# Altium project MPPT_controller.PrjPcb (part 1 of 2)
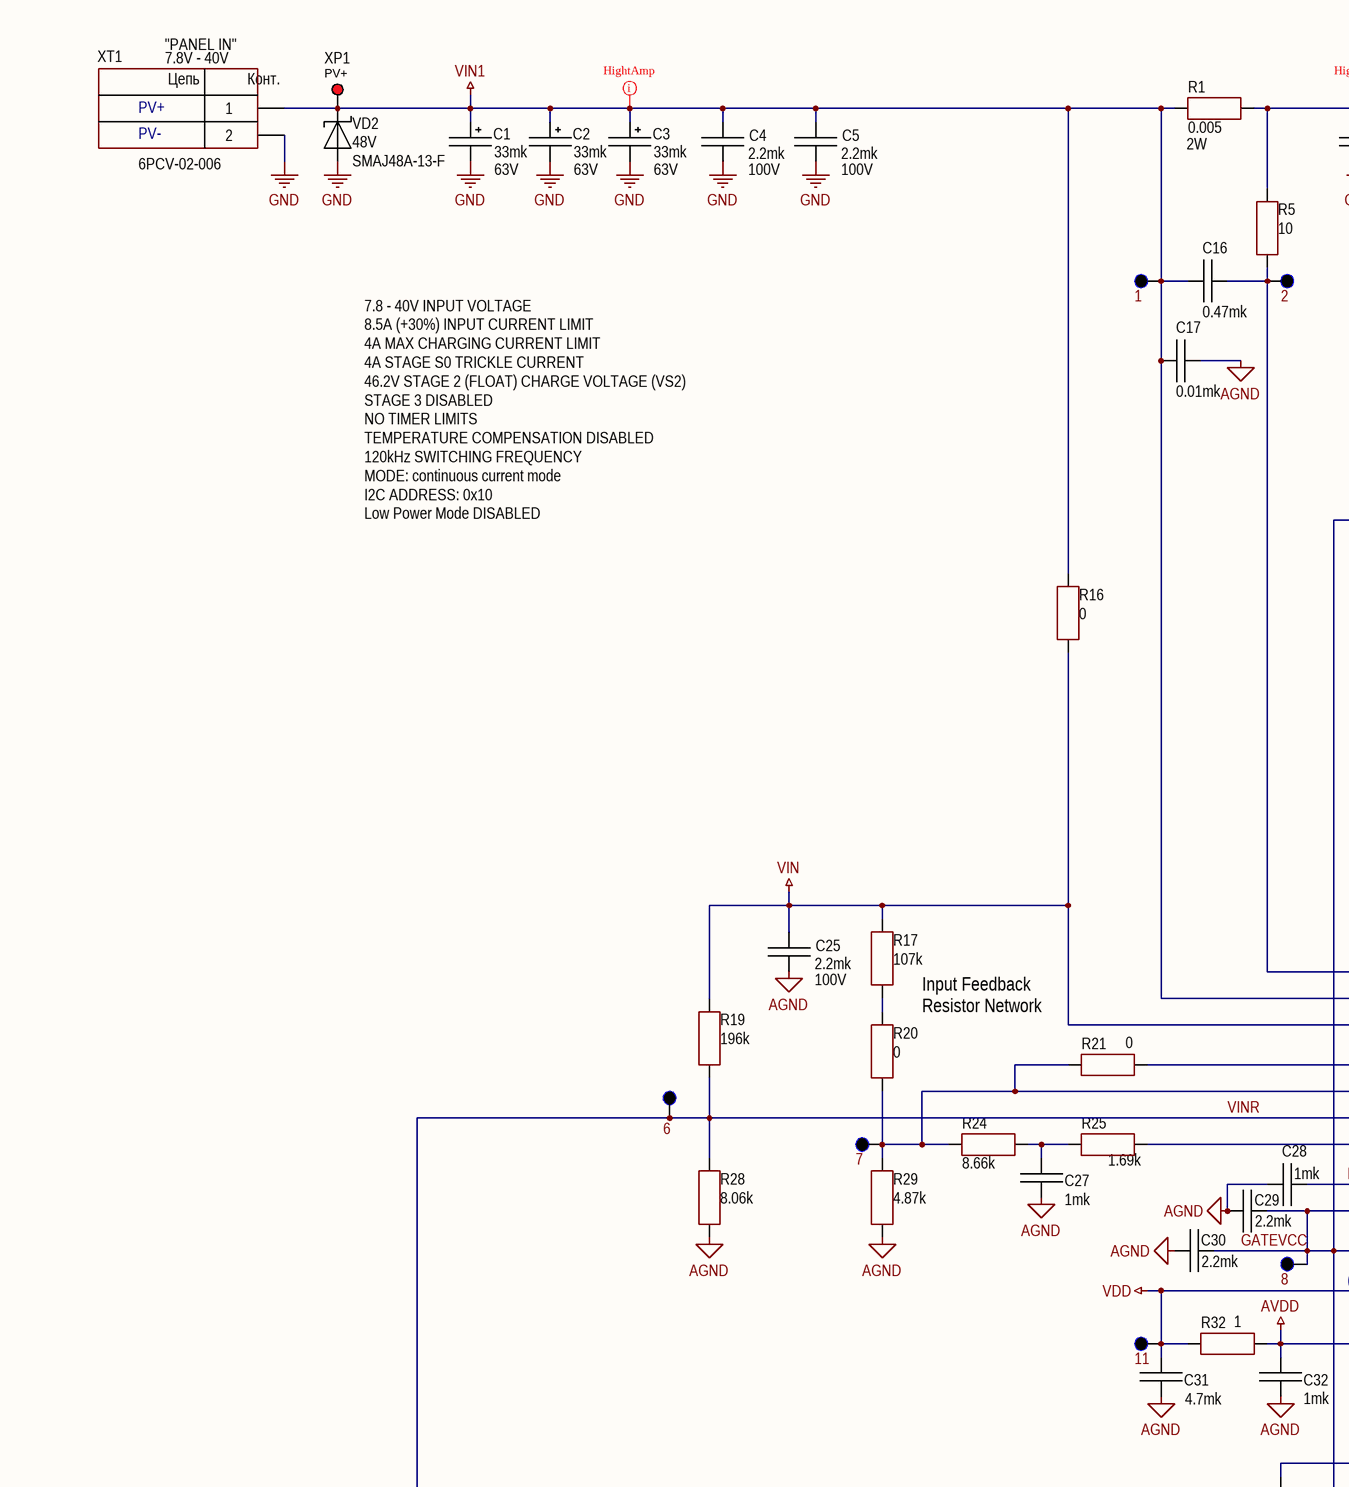
[diagram p0: Sheet1.SchDoc, top left]
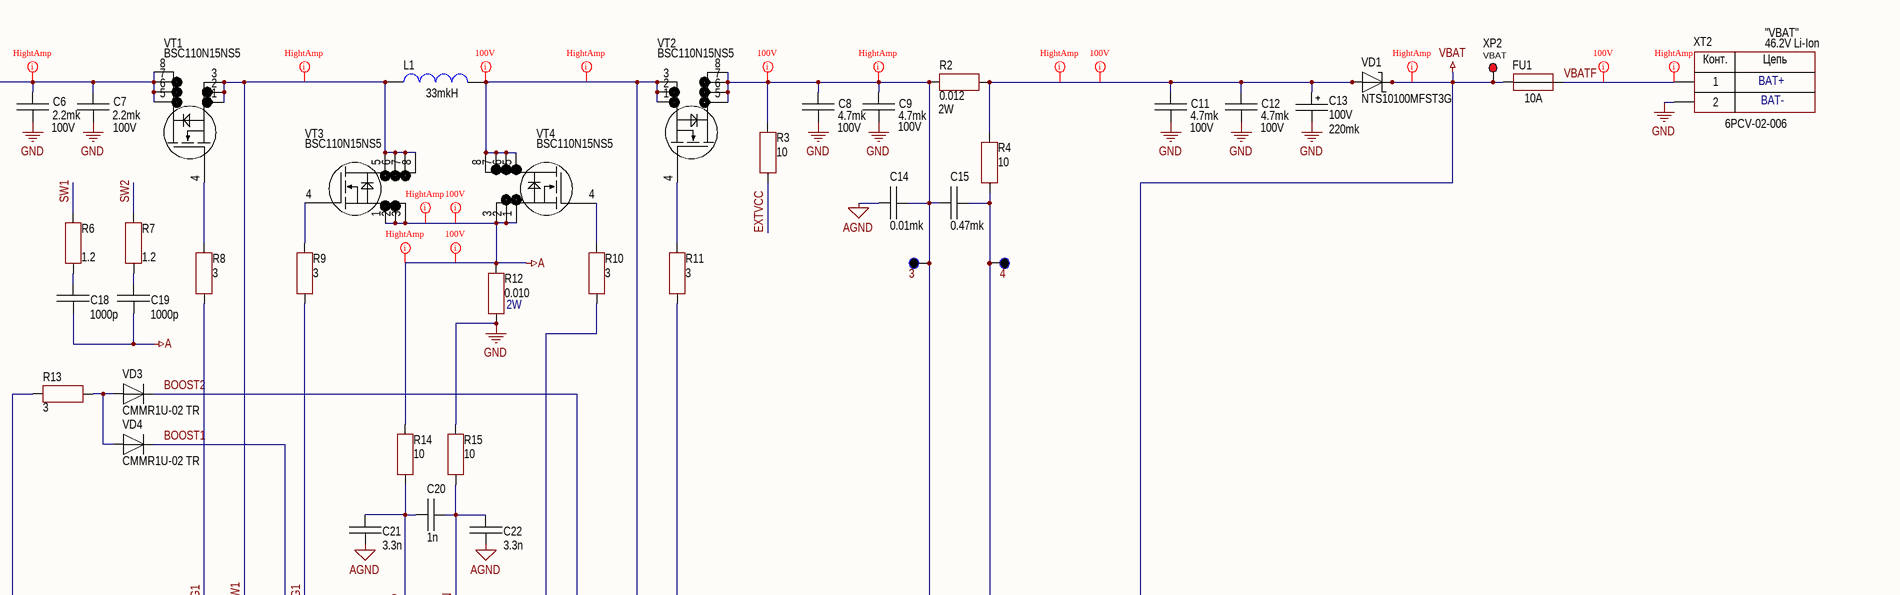
[diagram p1: Sheet1.SchDoc, top right]
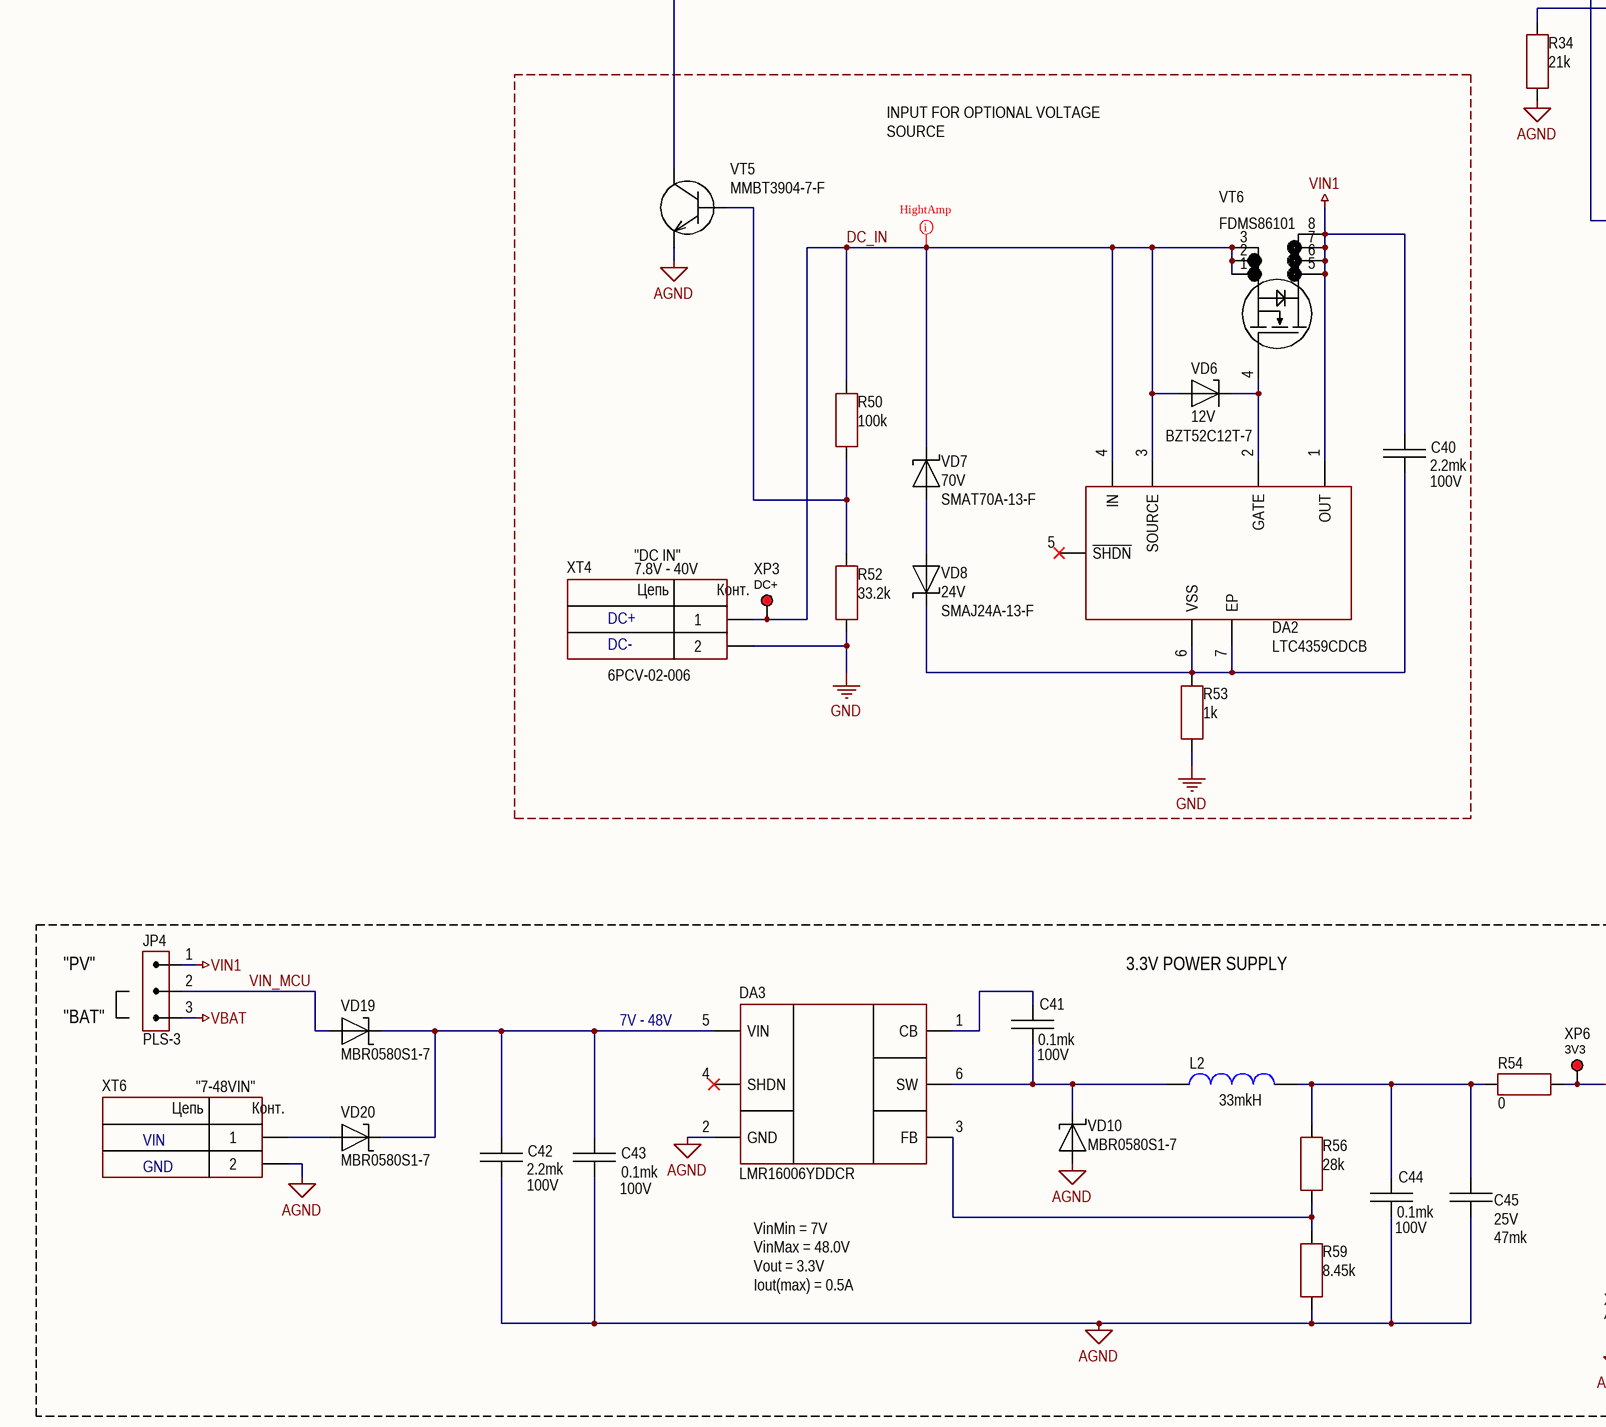
[diagram p2: Sheet1.SchDoc, bottom left]
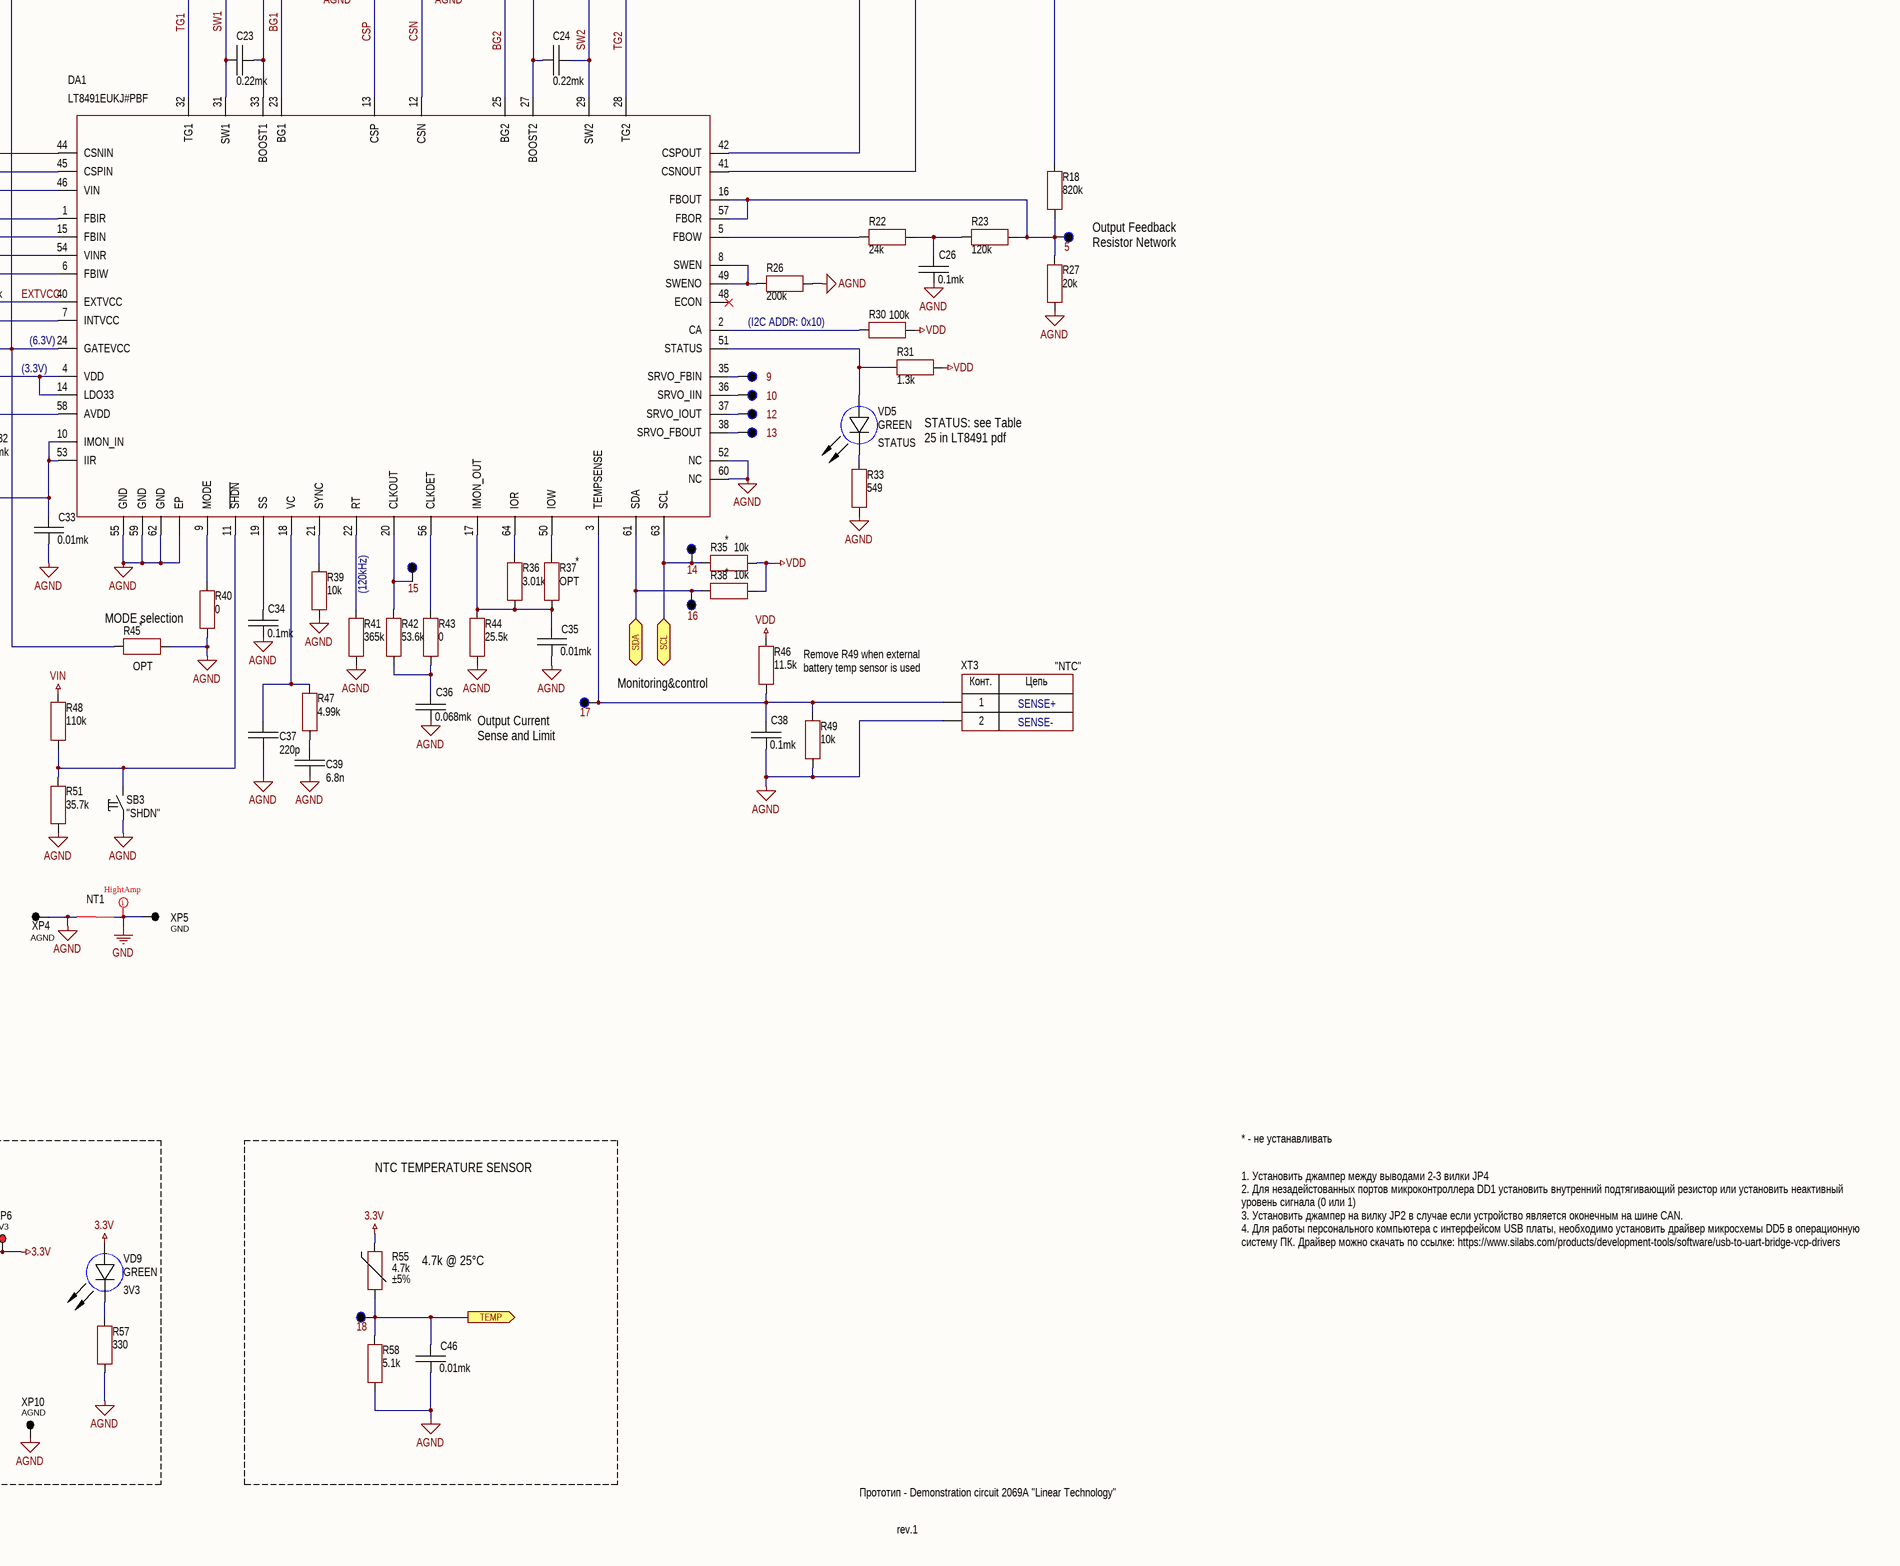
[diagram p3: Sheet1.SchDoc, bottom right]
2 sheets, 283 parts. Net scope: global (net labels, ports and power ports of the same name join across sheets).
Board file: PCB_MPPT_rev1.PcbDoc
Sheets:
  Sheet1.SchDoc
  Sheet2.SchDoc

## Sheet Sheet1.SchDoc
size 840 x 594 mm; Language: en; ResponsibleDept: DED; DocumentStatus: Released; DecimalNumber: {DecimalNumber}; CheckedBy: Грефенштейн; DrawnBy: Тихонов; SheetNumber: 1; SheetTotal: 2; Title0: Плата заряда аккумулятора; DocumentType: Схема электрическая принципиальная; PageSetup: Record=PageOptions|CenterHorizontal=True|CenterVertical=True|PrintScale=0.96|XCorrection=1.00|YCorrection=1.00|PrintKind=1|BorderSize=5000000|LeftOffset=0|BottomOffset=0|Orientation=2|PaperLength=1000|PaperWidth=1000|Scale=100|PaperSource=7|PrintQuality=-4|MediaType=1|DitherType=10|PaperKind=A3|PrintScaleMode=1

### Parts
1  test  [TEST_point_SMD]  (value not drawn)  (no BOM)
2  test  [TEST_point_SMD]  (value not drawn)  (no BOM)
3  test  [TEST_point_SMD]  (value not drawn)  (no BOM)
4  test  [TEST_point_SMD]  (value not drawn)  (no BOM)
5  test  [TEST_point_SMD]  (value not drawn)  (no BOM)
6  test  [TEST_point_SMD]  (value not drawn)  (no BOM)
7  test  [TEST_point_SMD]  (value not drawn)  (no BOM)
8  test  [TEST_point_SMD]  (value not drawn)  (no BOM)
9  test  [TEST_point_SMD]  (value not drawn)  (no BOM)
10  test  [TEST_point_SMD]  (value not drawn)  (no BOM)
11  test  [TEST_point_SMD]  (value not drawn)  (no BOM)
12  test  [TEST_point_SMD]  (value not drawn)  (no BOM)
13  test  [TEST_point_SMD]  (value not drawn)  (no BOM)
14  test  [TEST_point_SMD]  (value not drawn)  (no BOM)
15  test  [TEST_point_SMD]  (value not drawn)  (no BOM)
16  test  [TEST_point_SMD]  (value not drawn)  (no BOM)
17  test  [TEST_point_SMD]  (value not drawn)  (no BOM)
18  test  [TEST_point_SMD]  (value not drawn)  (no BOM)
C1  value 33mk  Voltage: 63V  [CAP: EEH-ZA_SIZE-F]
C2  value 33mk  Voltage: 63V  [CAP: EEH-ZA_SIZE-F]
C3  value 33mk  Voltage: 63V  [CAP: EEH-ZA_SIZE-F]
C4  value 2.2mk  Voltage: 100V  [CAP: 1210]
C5  value 2.2mk  Voltage: 100V  [CAP: 1210]
C6  value 2.2mk  Voltage: 100V  [CAP: 1210]
C7  value 2.2mk  Voltage: 100V  [CAP: 1210]
C8  value 4.7mk  Voltage: 100V  [CAP: 1812]
C9  value 4.7mk  Voltage: 100V  [CAP: 1812]
C11  value 4.7mk  Voltage: 100V  [CAP: 1812]
C12  value 4.7mk  Voltage: 100V  [CAP: 1812]
C13  value 220mk  Voltage: 100V  [CAP: D13C5H25]
C14  value 0.01mk  [CAP: 0603]
C15  value 0.47mk  [CAP: 0603]
C16  value 0.47mk  [CAP: 0603]
C17  value 0.01mk  [CAP: 0603]
C18  value 1000p  [CAP: 1206]
C19  value 1000p  [CAP: 1206]
C20  value 1n  [CAP: 0603]
C21  value 3.3n  [CAP: 0603]
C22  value 3.3n  [CAP: 0603]
C23  value 0.22mk  [CAP: 0603]
C24  value 0.22mk  [CAP: 0603]
C25  value 2.2mk  Voltage: 100V  [CAP: 1210]
C26  value 0.1mk  [CAP: 0603]
C27  value 1mk  [CAP: 0603]
C28  value 1mk  [CAP: 1210]
C29  value 2.2mk  [CAP: 0603]
C30  value 2.2mk  [CAP: 0603]
C31  value 4.7mk  [CAP: 0805]
C32  value 1mk  [CAP: 0603]
C33  value 0.01mk  [CAP: 0603]
C34  value 0.1mk  [CAP: 0603]
C35  value 0.01mk  [CAP: 0603]
C36  value 0.068mk  [CAP: 0603]
C37  value 220p  [CAP: 0603]
C38  value 0.1mk  [CAP: 0603]
C39  value 6.8n  [CAP: 0603]
C40  value 2.2mk  Voltage: 100V  [CAP: 1210]
C41  value 0.1mk  Voltage: 100V  [CAP: 0603]
C42  value 2.2mk  Voltage: 100V  [CAP: 1210]
C43  value 0.1mk  Voltage: 100V  [CAP: 0603]
C44  value 0.1mk  Voltage: 100V  [CAP: 0603]
C45  value 47mk  Voltage: 25V  [CAP: 1206]
C46  value 0.01mk  [CAP: 0603]
DA1  LT8491EUKJ#PBF  [64-Lead Plastic QFN]
DA2  (no value)  [6-DFN-6_DCB-M]
DA3  (no value)  [SOT23-6 Thin]
FU1  value 10A  [FUSE: 01110501Z (5x20 mm)]
JP4  (no value)  [CON: PLS-3]
L1  value 33mkH  [IND: WE-HCF_2013]
L2  value 33mkH  [IND: SRU8043]
NT1  (no value)  [NetTie_0805_2]  (net tie, no BOM)
R1  value 0.005  Power: 2W  [RES: 2512]
R2  value 0.012  Power: 2W  [RES: 2512]
R3  value 10  [RES: 0603]
R4  value 10  [RES: 0603]
R5  value 10  [RES: 0603]
R6  value 1.2  [RES: 1206]
R7  value 1.2  [RES: 1206]
R8  value 3  [RES: 0603]
R9  value 3  [RES: 0603]
R10  value 3  [RES: 0603]
R11  value 3  [RES: 0603]
R12  value 0.010  Power: 2W  [RES: 2512]
R13  value 3  [RES: 0603]
R14  value 10  [RES: 0603]
R15  value 10  [RES: 0603]
R16  value 0  [RES: 0603]
R17  value 107k  [RES: 0603]
R18  value 820k  [RES: 0603]
R19  value 196k  [RES: 0603]
R20  value 0  [RES: 0603]
R21  value 0  [RES: 0603]
R22  value 24k  [RES: 0603]
R23  value 120k  [RES: 0603]
R24  value 8.66k  [RES: 0603]
R25  value 1.69k  [RES: 0603]
R26  value 200k  [RES: 0603]
R27  value 20k  [RES: 0603]
R28  value 8.06k  [RES: 0603]
R29  value 4.87k  [RES: 0603]
R30  value 100k  [RES: 0603]
R31  value 1.3k  [RES: 0603]
R32  value 1  [RES: 0603]
R33  value 549  [RES: 0603]
R34  value 21k  [RES: 0603]
R35  value 10k  [RES: 0603]
R36  value 3.01k  [RES: 0603]
R37  ShowComment: OPT  [RES: 0603]
R38  value 10k  [RES: 0603]
R39  value 10k  [RES: 0603]
R40  value 0  [RES: 0603]
R41  value 365k  [RES: 0603]
R42  value 53.6k  [RES: 0603]
R43  value 0  [RES: 0603]
R44  value 25.5k  [RES: 0603]
R45  ShowComment: OPT  [RES: 0603]
R46  value 11.5k  [RES: 0603]
R47  value 4.99k  [RES: 0603]
R48  value 110k  [RES: 0603]
R49  value 10k  [RES: 0603]
R50  value 100k  [RES: 0603]
R51  value 35.7k  [RES: 0603]
R52  value 33.2k  [RES: 0603]
R53  value 1k  [RES: 0603]
R54  value 0  [RES: 0603]
R55  value 4.7k  Tolerance: ±5%  [RES: 0805]
R56  value 28k  [RES: 0603]
R57  value 330  [RES: 0603]
R58  value 5.1k  [RES: 0805]
R59  value 8.45k  [RES: 0603]
SB3  CommentText: "SHDN"  [BUT: 6x6 SMD]
VD1  PartNumber: NTS10100MFST3G  [PG-TDSON-8-7]
VD2  Voltage: 48V  PartNumber: SMAJ48A-13-F  [DIODE: SMA]
VD3  PartNumber: CMMR1U-02 TR  [DIODE: SOD123F]
VD4  PartNumber: CMMR1U-02 TR  [DIODE: SOD123F]
VD5  Color: GREEN  ShowComment: STATUS  [LED: 0603G]
VD6  Voltage: 12V  PartNumber: BZT52C12T-7  [DIODE: SOD523]
VD7  Voltage: 70V  PartNumber: SMAT70A-13-F  [DIODE: SMA]
VD8  Voltage: 24V  PartNumber: SMAJ24A-13-F  [DIODE: SMA]
VD9  Color: GREEN  ShowComment: 3V3  [LED: 0603G]
VD10  PartNumber: MBR0580S1-7  [DIODE: SMA]
VD19  PartNumber: MBR0580S1-7  [DIODE: SMA]
VD20  PartNumber: MBR0580S1-7  [DIODE: SMA]
VT1  PartNumber: BSC110N15NS5  [PG-TDSON-8-7]  (hidden comment: MOSFET N-ch, 150V, PG-TDSON-8)
VT2  PartNumber: BSC110N15NS5  [PG-TDSON-8-7]  (hidden comment: MOSFET N-ch, 150V, PG-TDSON-8)
VT3  PartNumber: BSC110N15NS5  [PG-TDSON-8-7]  (hidden comment: MOSFET N-ch, 150V, PG-TDSON-8)
VT4  PartNumber: BSC110N15NS5  [PG-TDSON-8-7]  (hidden comment: MOSFET N-ch, 150V, PG-TDSON-8)
VT5  PartNumber: MMBT3904-7-F  [SOT23]
VT6  PartNumber: FDMS86101  [PG-TDSON-8-7]
XP1  PV+  [CON: Keystone5000]
XP2  VBAT  [CON: Keystone5000]
XP3  DC+  [CON: Keystone5000]
XP4  AGND  [CON: Keystone5001]
XP5  GND  [CON: Keystone5001]
XP6  3V3  [CON: Keystone5000]
XP10  AGND  [CON: Keystone5001]
XT1  PartNumber: 6PCV-02-006  CommentText: "PANEL IN"  row1: PV+  row2: PV-  [CON: 6PCV-02-006]
XT2  PartNumber: 6PCV-02-006  CommentText: "VBAT"  row1: BAT+  row2: BAT-  [CON: 6PCV-02-006]
XT3  CommentText: "NTC"  row1: SENSE+  row2: SENSE-  [CON: DG350-3.5-02P]
XT4  PartNumber: 6PCV-02-006  CommentText: "DC IN"  row1: DC+  row2: DC-  [CON: 6PCV-02-006]
XT6  CommentText: "7-48VIN"  row1: VIN  row2: GND  [CON: DG350-3.5-02P]

### Blocks framed on the sheet
7.8V - 40V: C40 DA2 R50 R52 R53 VD6-VD8 VT5 VT6 XP3 XT4
7V - 48V: C41-C45 DA3 JP4 L2 R54 R56 R57 R59 VD9 VD10 VD19 VD20 XP6 XP10 XT6

### Ports
SCL (bidir), SDA (bidir), TEMP (out)

### Nets
3.3V: R54.1 R55.2 VD9.1(A) XP6.1
A: C18.1 C19.1 R12.2 R14.1 VT3.1(S) VT3.2(S) VT3.3(S) VT4.1(S) VT4.2(S) VT4.3(S)
AGND: C14.1 C17.1 C21.2 C22.2 C25.1 C26.1 C27.1 C28.2 C29.1 C30.2 C31.1 C32.1 C33.1 C34.1 C35.1 C36.1 C37.1 C38.1 C39.1 C42.1 C43.1 C44.1 C45.1 C46.1 DA1.52(NC) DA1.55(GND) DA1.59(GND) DA1.60(NC) DA1.62(GND) DA1.65(EP) DA3.2(GND) NT1.1 R26.2 R27.1 R28.2 R29.2 R33.1 R34.1 R39.1 R40.1 R41.1 R44.1 R45.1 R49.1 R51.1 R57.1 R58.2 R59.1 SB3.1 VD10.1 VT5.2(E) XP4.1 XP10.1 XT3.2 XT6.2
AVDD: C32.2 DA1.58(AVDD) R32.2
GND: C1.2 C2.2 C3.2 C4.1 C5.1 C6.1 C7.1 C8.1 C9.1 C11.1 C12.1 C13.2 NT1.2 R12.1 R15.1 R52.1 R53.2 VD2.1(A) XP5.1 XT1.2 XT2.2 XT4.2
VBAT: FU1.1 JP4.3 R18.2 VD1.5(C) VD1.8(C) XP2.1
VDD: 11.1 C31.2 DA1.4(VDD) DA1.14(LDO33) R30.2 R31.2 R32.1 R35.1 R38.1 R46.2
VIN: C25.2 DA1.46(VIN) R16.2 R17.1 R19.1 R48.2
VIN1: 1.1 C1.1 C2.1 C3.1 C4.2 C5.2 C16.1 C17.2 C40.2 DA1.45(CSPIN) DA2.1(OUT) JP4.1 R1.2 R16.1 VD2.2(C) VT6.5(D) VT6.6(D) VT6.7(D) VT6.8(D) XP1.1 XT1.1
BG1: DA1.23(BG1) R9.1
BG2: DA1.25(BG2) R10.1
BOOST1: C23.2 DA1.33(BOOST1) VD4.2
BOOST2: C24.1 DA1.27(BOOST2) VD3.2
CSN: C20.1 C22.1 DA1.12(CSN) R15.2
CSP: C20.2 C21.1 DA1.13(CSP) R14.2
DC_IN: DA2.3(SOURCE) DA2.4(IN) R50.2 VD6.1(A) VD7.2(C) VT6.1(S) VT6.2(S) VT6.3(S) XP3.1 XT4.1
EXTVCC: C28.1 DA1.40(EXTVCC) R3.2
GATEVCC: 8.1 C29.2 C30.1 DA1.7(INTVCC) DA1.24(GATEVCC) R13.2 R45.2
SCL: 14.1 DA1.63(SCL) R35.2 ; port SCL
SDA: 16.1 DA1.61(SDA) R38.2 ; port SDA
SW1: C23.1 DA1.31(SW1) L1.2 R6.2 VT1.1(S) VT1.2(S) VT1.3(S) VT3.5(D) VT3.6(D) VT3.7(D) VT3.8(D)
SW2: C24.2 DA1.29(SW2) L1.1 R7.2 VT2.1(S) VT2.2(S) VT2.3(S) VT4.5(D) VT4.6(D) VT4.7(D) VT4.8(D)
TEMP: 18.1 C46.2 R55.1 R58.1 ; port TEMP
TG1: DA1.32(TG1) R8.1
TG2: DA1.28(TG2) R11.1
VBATF: FU1.2 XT2.1
VIN_MCU: JP4.2 VD19.1
VINR: 6.1 DA1.54(VINR) R19.2 R28.1 VT5.3(C)
Net2_1: 2.1 C16.2 DA1.44(CSNIN) R5.2
Net3_1: 3.1 C8.2 C9.2 C14.2 C15.1 DA1.42(CSPOUT) R2.2 R3.1 VT2.5(D) VT2.6(D) VT2.7(D) VT2.8(D)
Net4_1: 4.1 C15.2 DA1.41(CSNOUT) R4.2
Net5_1: 5.1 DA1.16(FBOUT) DA1.57(FBOR) R18.1 R23.1 R27.2
Net7_1: 7.1 DA1.15(FBIN) R20.2 R21.1 R24.1 R29.1
Net9_1: 9.1 DA1.35(SRVO_FBIN)
Net10_1: 10.1 DA1.36(SRVO_IIN)
Net12_1: 12.1 DA1.37(SRVO_IOUT)
Net13_1: 13.1 DA1.38(SRVO_FBOUT)
Net15_1: 15.1 DA1.20(CLKOUT) R42.2
Net17_1: 17.1 C38.2 DA1.3(TEMPSENSE) R46.1 R49.2 XT3.1
NetC6_2: C6.2 C7.2 R1.1 R5.1 VT1.5(D) VT1.6(D) VT1.7(D) VT1.8(D)
NetC11_2: C11.2 C12.2 C13.1 R2.1 R4.1 VD1.1(A) VD1.2(A) VD1.3(A)
NetC18_2: C18.2 R6.1
NetC19_2: C19.2 R7.1
NetC26_2: C26.2 R22.1 R23.2
NetC27_2: C27.2 R24.2 R25.1
NetC33_2: C33.2 DA1.10(IMON_IN) DA1.53(IIR) R34.2
NetC34_2: C34.2 DA1.19(SS)
NetC35_2: C35.2 DA1.17(IMON_OUT) R36.1 R37.2 R44.2
NetC36_2: C36.2 R42.1 R43.1
NetC37_2: C37.2 DA1.18(VC) R47.2
NetC39_2: C39.2 R47.1
NetC40_1: C40.1 DA2.6(VSS) DA2.7(EP) R53.1 VD8.2(C)
NetC41_1: C41.1 DA3.6(SW) L2.2 VD10.2
NetC41_2: C41.2 DA3.1(CB)
NetC42_2: C42.2 C43.2 DA3.5(VIN) VD19.2 VD20.2
NetC44_2: C44.2 C45.2 L2.1 R54.2 R56.2
NetDA1_1: DA1.1(FBIR) R21.2
NetDA1_2: DA1.2(CA) R30.1
NetDA1_5: DA1.5(FBOW) R22.2
NetDA1_6: DA1.6(FBIW) R25.2
NetDA1_8: DA1.8(SWEN) DA1.49(SWENO) R26.1
NetDA1_9: DA1.9(MODE) R40.2
NetDA1_11: DA1.11(~{SHDN}) R48.1 R51.2 SB3.2
NetDA1_21: DA1.21(SYNC) R39.2
NetDA1_22: DA1.22(RT) R41.2
NetDA1_50: DA1.50(IOW) R37.1
NetDA1_51: DA1.51(STATUS) R31.1 VD5.1(A)
NetDA1_56: DA1.56(CLKDET) R43.2
NetDA1_64: DA1.64(IOR) R36.2
NetDA2_2: DA2.2(GATE) VD6.2(C) VT6.4(G)
NetDA3_3: DA3.3(FB) R56.1 R59.2
NetR8_2: R8.2 VT1.4(G)
NetR9_2: R9.2 VT3.4(G)
NetR10_2: R10.2 VT4.4(G)
NetR11_2: R11.2 VT2.4(G)
NetR13_1: R13.1 VD3.1 VD4.1
NetR17_2: R17.2 R20.1
NetR33_2: R33.2 VD5.2(C)
NetR50_1: R50.1 R52.2 VT5.1(B)
NetR57_2: R57.2 VD9.2(C)
NetVD7_1: VD7.1(A) VD8.1(A)
NetVD20_1: VD20.1 XT6.1

Not connected (* = marked no-connect by the designer): DA1 48(ECON)*; DA2 5(~{SHDN})*; DA3 4(SHDN)*

### Layout directives
net class 100V: A, Net3_1, NetC11_2, SW2, VBATF
net class HightAmp: A, DC_IN, GND, Net3_1, NetC6_2, NetC11_2, SW1, SW2, VBAT, VBATF, VIN1

### Notes on the sheet
- (near XT1) 7.8V - 40V
- 46.2V Li-Ion
- 7.8 - 40V INPUT VOLTAGE
  8.5A (+30%) INPUT CURRENT LIMIT
  4A MAX CHARGING CURRENT LIMIT
  4A STAGE S0 TRICKLE CURRENT
  46.2V STAGE 2 (FLOAT) CHARGE VOLTAGE (VS2)
  STAGE 3 DISABLED
  NO TIMER LIMITS
  TEMPERATURE COMPENSATION DISABLED
  120kHz SWITCHING FREQUENCY
  MODE: continuous current mode
  I2C ADDRESS: 0x10
  Low Power Mode DISABLED
- Input Feedback Resistor Network
- Output Feedback Resistor Network
- (I2C ADDR: 0x10)
- (near DA1) (3.3V)
- (near DA1) (6.3V)
- STATUS: see Table 25 in LT8491 pdf
- (near R37) *
- *
- INPUT FOR OPTIONAL VOLTAGE SOURCE
- (120kHz)
- (near R35) *
- (near R40) MODE selection
- (near R45) *
- (near 17) Monitoring&control
- Remove R49 when external battery temp sensor is used
- (near 17) Output Current
  Sense and Limit
- (near JP4) "PV"
- * - не устанавливать
- (near JP4) "BAT"
- 3.3V POWER SUPPLY
- NTC TEMPERATURE SENSOR
- 1. Установить джампер между выводами 2-3 вилки JP4
  2. Для незадейстованных портов микроконтроллера DD1 установить внутренний подтягивающий резистор или установить неактивный уровень сигнала (0 или 1)
  3. Установить джампер на вилку JP2 в случае если устройство является оконечным на шине CAN.
  4. Для работы персонального компьютера с интерфейсом USB платы, необходимо установить драйвер микросхемы DD5 в операционную систему ПК. Драйвер можно скачать по ссылке: https://www.silabs.com/products/development-tools/software/usb-to-uart-bridge-vcp-drivers
- 4.7k @ 25°C
- VinMin = 7V
  VinMax = 48.0V
  Vout = 3.3V
  Iout(max) = 0.5A
- Прототип - Demonstration circuit 2069A "Linear Technology"
- rev.1
- Перв. примен.
- Справ. №
- Подп. и дата
- Инв. № дубл.
- Взам. инв. №
- Изм.
- Лист
- № докум.
- Подп.
- Дата
- Лит.
- Масса
- Масштаб
- Разраб.
- Пров.
- Т. контр.
- Листов
- Инв. № подл.
- Н. контр.
- Утв.
- Копировал
- Формат A1
- (in symbol Connector_6PCV-02) Цепь; Конт.
- (in symbol Connector_terminal_2pin) Конт.; Цепь

### Library data of the parts
1-18 = TEST point: Контактная площадка без компонента
C1-C3 = Aluminium: Manufacturer: Panasonic; PartNumber: EEH-ZA1J330P; ValueManufacturerPartNumber: EP-cap, 33mk, 63V, ±20%; TypeCapacitor: EP-cap; Tolerance: ±20%; Impedance: 40mOhm; Package: 8x8.3x10.5 mm; HelpURL: https://www.digikey.com/product-detail/en/panasonic-electronic-components/EEH-ZA1J330P/P15448CT-ND/3088162; Temperature: -55...+105°C
C4-C7 C25 C40 C42 = Ceramic_1210: Manufacturer: AVX; PartNumber: 12101C225KAT2A; ValueManufacturerPartNumber: CAP CER, 2.2mk, X7R, ±10%, 100V, 1210; TypeCapacitor: CAP CER; Tolerance: ±10%; TypeDielectric: X7R; Package: 1210; HelpURL: https://www.digikey.com/product-detail/en/avx-corporation/12101C225KAT2A/478-7974-1-ND/3881597; Temperature: -55...+125°C
  C40 C42: ClassName: Polygon_direct
C8 C9 C11 C12 = Ceramic_1812: Manufacturer: TDK; PartNumber: C4532X7S2A475M230KB; ValueManufacturerPartNumber: CAP CER, 4.7mk, X7S, ±20%, 100V, 1812; TypeCapacitor: CAP CER; Tolerance: ±20%; TypeDielectric: X7S; Package: 1812; HelpURL: https://www.digikey.com/product-detail/en/tdk-corporation/C4532X7S2A475M230KB/445-5211-1-ND/2116346; Temperature: -55...+125°C
C13 = Aluminium: Manufacturer: United Chemi-Con; PartNumber: EKZE101ELL221MK25S; ValueManufacturerPartNumber: CAP ALUM, 220mk, 100V, ±20%; TypeCapacitor: CAP ALUM; Tolerance: ±20%; ESR: 47mOhm; Package: dia=12.5 x h=25 x step=5 mm; HelpURL: https://www.digikey.com/product-detail/en/united-chemi-con/EKZE101ELL221MK25S/565-1739-ND/756255; Temperature: -40...+105°C
C14 C17 C33 C35 C46 = Ceramic_0603: Manufacturer: AVX; PartNumber: 06031C103KAT2A; ValueManufacturerPartNumber: CAP CER, 0.01mk, X7R, ±10%, 100V, 0603; TypeCapacitor: CAP CER; Tolerance: ±10%; TypeDielectric: X7R; Voltage: 100V; Package: 0603; HelpURL: https://www.digikey.com/product-detail/en/avx-corporation/06031C103KAT2A/478-1205-2-ND/563315; Temperature: -55...+125°C
C15 C16 = Ceramic_0603: Manufacturer: Murata; PartNumber: GRM188R71C474KA88D; ValueManufacturerPartNumber: CAP CER, 0.47mk, X7R, ±10%, 16V, 0603; TypeCapacitor: CAP CER; Tolerance: ±10%; TypeDielectric: X7R; Voltage: 16V; Package: 0603; HelpURL: https://www.digikey.com/product-detail/en/murata-electronics/GRM188R71C474KA88D/490-3295-1-ND/702836; Temperature: -55...+125°C
C18 C19 = Ceramic_1206: Manufacturer: AVX; PartNumber: 12061A102KAT2A; ValueManufacturerPartNumber: CAP CER, 1000p, NP0, ±10%, 100V, 1206; TypeCapacitor: CAP CER; Tolerance: ±10%; TypeDielectric: NP0; Voltage: 100V; Package: 1206; HelpURL: https://www.digikey.com/product-detail/en/avx-corporation/12061A102KAT2A/478-5168-1-ND/1913258; Temperature: -55...+125°C
C20 = Ceramic_0603: Manufacturer: AVX; PartNumber: 0603YC102MAT4A; ValueManufacturerPartNumber: CAP CER, 1n, X7R, ±20%, 16V, 0603; TypeCapacitor: CAP CER; Tolerance: ±20%; TypeDielectric: X7R; Voltage: 16V; Package: 0603; HelpURL: https://www.digikey.com/products/en?keywords=0603YC102MAT4A; Temperature: -55...+125°C
C21 C22 = Ceramic_0603: Manufacturer: AVX; PartNumber: 0603YC332MAT4A; ValueManufacturerPartNumber: CAP CER, 3.3n, X7R, ±20%, 16V, 0603; TypeCapacitor: CAP CER; Tolerance: ±20%; TypeDielectric: X7R; Voltage: 16V; Package: 0603; HelpURL: https://www.digikey.com/products/en?keywords=0603YC102MAT4A; Temperature: -55...+125°C
C23 C24 = Ceramic_0603: Manufacturer: AVX; PartNumber: 0603YD224KAT2A; ValueManufacturerPartNumber: CAP CER, 0.22mk, X5R, ±20%, 16V, 0603; TypeCapacitor: CAP CER; Tolerance: ±20%; TypeDielectric: X5R; Voltage: 16V; Package: 0603; HelpURL: https://www.digikey.com/product-detail/en/avx-corporation/0603YD224KAT2A/478-1246-1-ND/564278; Temperature: -55...+85°C
C26 C34 C38 = Ceramic_0603: Manufacturer: AVX; PartNumber: 06031C104KAT2A; ValueManufacturerPartNumber: CAP CER, 0.1mk, X7R, ±10%, 100V, 0603; TypeCapacitor: CAP CER; Tolerance: ±10%; TypeDielectric: X7R; Voltage: 100V; Package: 0603; HelpURL: https://www.digikey.com/product-detail/en/avx-corporation/06031C104KAT2A/478-10047-1-ND/6564270; Temperature: -55...+125°C
C27 C32 = Ceramic_0603: Manufacturer: AVX; PartNumber: 0603YC105KAT2A; ValueManufacturerPartNumber: CAP CER, 1mk, X7R, ±10%, 16V, 0603; TypeCapacitor: CAP CER; Tolerance: ±10%; TypeDielectric: X7R; Voltage: 16V; Package: 0603; HelpURL: https://www.digikey.com/product-detail/en/avx-corporation/0603YC105KAT2A/478-5010-1-ND/1888221; Temperature: -55...+125°C
C28 = Ceramic_1210: Manufacturer: AVX; PartNumber: 12101C105KAT2A; ValueManufacturerPartNumber: CAP CER, 1mk, X7R, ±10%, 100V, 1210; TypeCapacitor: CAP CER; Tolerance: ±10%; TypeDielectric: X7R; Voltage: 100V; Package: 1210; HelpURL: https://www.digikey.com/product-detail/en/avx-corporation/12101C105KAT2A/478-2570-1-ND/717515; Temperature: -55...+125°C
C29 C30 = Ceramic_0603: Manufacturer: AVX; PartNumber: 0603ZD225KAT2A; ValueManufacturerPartNumber: CAP CER, 2.2mk, X5R, ±10%, 10V, 0603; TypeCapacitor: CAP CER; Tolerance: ±10%; TypeDielectric: X5R; Voltage: 10V; Package: 0603; HelpURL: https://www.digikey.com/product-detail/en/avx-corporation/0603ZD225KAT2A/478-6212-1-ND/2391411; Temperature: -55...+85°C
C31 = Ceramic_0805: Manufacturer: AVX; PartNumber: 0805YC475KAT2A; ValueManufacturerPartNumber: CAP CER, 4.7mk, X7R, ±10%, 16V, 0805; TypeCapacitor: CAP CER; Tolerance: ±10%; TypeDielectric: X7R; Voltage: 16V; Package: 0805; HelpURL: https://www.digikey.com/product-detail/en/avx-corporation/0805YC475KAT2A/478-5722-1-ND/2136330; Temperature: -55...+125°C
C36 = Ceramic_0603: Manufacturer: AVX; PartNumber: 0603YC683KAT2A; ValueManufacturerPartNumber: CAP CER, 0.068mk, X7R, ±10%, 16V, 0603; TypeCapacitor: CAP CER; Tolerance: ±10%; TypeDielectric: X7R; Voltage: 16V; Package: 0603; HelpURL: https://www.digikey.com/product-detail/en/avx-corporation/0603YC683KAT2A/478-1237-1-ND/564269; Temperature: -55...+125°C
C37 = Ceramic_0603: Manufacturer: AVX; PartNumber: 06033A221JAT2A; ValueManufacturerPartNumber: CAP CER, 220p, X7R, ±5%, 25V, 0603; TypeCapacitor: CAP CER; Tolerance: ±5%; TypeDielectric: X7R; Voltage: 25V; Package: 0603; HelpURL: https://www.digikey.com/product-detail/en/avx-corporation/06033A221JAT2A/478-12678-2-ND/1599160; Temperature: -55...+125°C
C39 = Ceramic_0603: Manufacturer: AVX; PartNumber: 06035C682KAT2A; ValueManufacturerPartNumber: CAP CER, 6.8n, X7R, ±10%, 50V, 0603; TypeCapacitor: CAP CER; Tolerance: ±10%; TypeDielectric: X7R; Voltage: 50V; Package: 0603; HelpURL: https://www.digikey.com/product-detail/en/avx-corporation/06035C682KAT2A/478-1225-1-ND/564257; Temperature: -55...+125°C
C41 C43 C44 = Ceramic_0603: Manufacturer: AVX; PartNumber: 06031C104KAT2A; ValueManufacturerPartNumber: CAP CER, 0.1mk, X7R, ±10%, 100V, 0603; TypeCapacitor: CAP CER; Tolerance: ±10%; TypeDielectric: X7R; Package: 0603; HelpURL: https://www.digikey.com/product-detail/en/avx-corporation/06031C104KAT2A/478-10047-1-ND/6564270; Temperature: -55...+125°C
  C43 C44: ClassName: Polygon_direct
C45 = Ceramic_1206: Manufacturer: TDK; PartNumber: C3216X5R1E476M160AC; ValueManufacturerPartNumber: CAP CER, 47mk, X5R, ±10%, 25V, 1206; TypeCapacitor: CAP CER; Tolerance: ±10%; TypeDielectric: X5R; Package: 1206; HelpURL: https://www.digikey.com/product-detail/en/tdk-corporation/C3216X5R1E476M160AC/445-8047-1-ND/2792164; Temperature: -55...+85°C; ClassName: Polygon_direct
DA1 = LT8491EUKJ#PBF: BUCK-BOOST BAT CH; Manufacturer: Linear Technology; ValueManufacturerPartNumber: Charger IC Lead Acid 64-QFN (7x11); Frequency: over 300kHz; VoltageInput: 80V max; Battery Pack Voltage: 1.3V ~ 80V; HelpURL: https://www.digikey.com/product-detail/en/linear-technology-analog-devices/LT8491EUKJ-PBF/161-LT8491EUKJ-PBF-ND/11586954; PartNumber: LT8491EUKJ#PBF; ComponentType: DC/DC buck converter; Package: 64-QFN (7x11); Temperature: -40...+125°C
DA2 = LTC4359CDCB: Ideal Diode Controller; Manufacturer: Linear Technology/Analog Devices; ValueManufacturerPartNumber: IC, Ideal Diode Controller, 6-DFN (2x3); VoltageInput: input 4...80V; HelpURL: https://www.digikey.com/product-detail/en/linear-technology-analog-devices/LTC4359CDCB-TRMPBF/LTC4359CDCB-TRMPBFCT-ND/5223322; Package: 6-DFN (2x3); ComponentType: IC, Ideal Diode Controller; Temperature: -0...+70°C; PartNumber: LTC4359CDCB; ClassName: Polygon_direct
DA3 = LMR16006YDDCR: Buck converter; Manufacturer: Texas Instruments; ValueManufacturerPartNumber: DC/DC buck converter, SOT23-6; VoltageInput: 4...60V; Frequency: 2.1MHz; CurrentOutput: 0.6A; VoltageOutput: 0.765...55V; HelpURL: https://www.digikey.com/product-detail/en/texas-instruments/LMR16006YDDCR/296-40294-1-ND/5178171; Package: SOT23-6; ComponentType: DC/DC buck converter; Temperature: -40...+125°C; PartNumber: LMR16006YDDCR; ClassName: Polygon_direct
FU1 = Fuse: Manufacturer: Littelfuse; ValueManufacturerPartNumber: FUSE CLIP, 250VAC, 10A, 5x20mm; PartNumber: 01110506Z; TypeFuse: FUSE CLIP; VoltageMax: 250VAC; Package: 5x20mm; HelpURL: https://www.digikey.com/product-detail/en/littelfuse-inc/01110506Z/F4083-ND/2519783; MaxCurrent: 10A; FUSE: https://www.digikey.com/product-detail/en/bel-fuse-inc/5HT-10-R/507-1217-ND/1008989
JP4 = Jumper_3pin: PLS-3; Manufacturer: Connfly; ValueManufacturerPartNumber: PLS-3 SINGLE ROW, 3pin, 2.54mm, 500VAC, 3A; PartNumber: DS1021-1x3; TypeConnector: PLS-3 SINGLE ROW; VoltageMax: 500VAC; Pitch: 2.54mm; CurrentMax: 3A; Multichannel: 3pin; HelpURL: https://www.chipdip.ru/product/pls-3?from=suggest_product; CommentText: PLS-3
L1 = Inductor_R22.9/14/7.62: Manufacturer: Würth Elektronik; PartNumber: 7443633300; ValueManufacturerPartNumber: Fixed inductor, 33mkH, ±15%, SMD Shielded, Ferrite (MnZn), , 12A; TypeInductor: Fixed inductor; TypeMatiriel: Ferrite (MnZn); Current: 12A; Tolerance: ±15%; Package: SMD Shielded; HelpURL: https://www.digikey.com/product-detail/en/w-rth-elektronik/7443633300/732-2524-1-ND/2440407; HelpURL1: https://www.digikey.com/product-detail/en/w%C3%BCrth-elektronik/7443632200/732-2523-1-ND/2440406; ClassName: Polygon_direct
L2 = Inductor_R22.9/14/7.62: Manufacturer: Bourns Inc.; PartNumber: SRU8043-330Y; ValueManufacturerPartNumber: Fixed inductor, 33mkH, ±15%, SMD Nonstandard, Ferrite, , 1.7A; TypeInductor: Fixed inductor; TypeMatiriel: Ferrite; Current: 1.7A; Tolerance: ±15%; Package: SMD Nonstandard; HelpURL: https://www.digikey.com/product-detail/en/bourns-inc/SRU8043-330Y/SRU8043-330YCT-ND/2353063; ClassName: Polygon_direct
NT1 = NetTie: ClassName: Polygon_direct
R1 = Resistor_2512: Manufacturer: Vishay; PartNumber: WSL25125L000FEA18; ValueManufacturerPartNumber: Res, SMD, 0.005, ±1%, 2512, 2W; TypeResistor: Res, SMD; Tolerance: ±1%; Package: 2512; HelpURL: https://www.digikey.com/product-detail/en/vishay-dale/WSL25125L000FEA18/WSLH-.005CT-ND/2695193; Temperature: -55...+125°C
R2 = Resistor_2512: Manufacturer: Vishay; PartNumber: WSL2512R0250FEA18; ValueManufacturerPartNumber: Res, SMD, 0.012, ±1%, 2512, 2W; TypeResistor: Res, SMD; Tolerance: ±1%; Package: 2512; HelpURL: https://www.digikey.com/product-detail/en/vishay-dale/WSL2512R0250FEA18/WSLH-.025CT-ND/2695207; Temperature: -55...+125°C; HelpURL1: https://www.digikey.com/product-detail/en/vishay-dale/WSL2512R0120FEA18/WSLH-012TR-ND/2695048
R3-R5 R14 R15 = Resistor_0603: Manufacturer: Vishay; PartNumber: CRCW060310R0JNEAC; ValueManufacturerPartNumber: Res, SMD, 10, ±5%, 0603, 0.1W; TypeResistor: Res, SMD; Power: 0.1W; Tolerance: ±5%; Package: 0603; HelpURL: https://www.digikey.com/product-detail/en/vishay-dale/CRCW060310R0JNEAC/541-4057-1-ND/7928740; Temperature: -55...+125°C
R6 R7 = Resistor_1206: Manufacturer: Vishay; PartNumber: CRCW12061R20FKEA; ValueManufacturerPartNumber: Resistor film, 1.2, ±5%, 1206, 0.25W; TypeResistor: Resistor film; Power: 0.25W; Tolerance: ±5%; Package: 1206; HelpURL: https://www.digikey.com/product-detail/en/vishay-dale/CRCW12061R20FKEA/541-1.20FFCT-ND/1962233; Temperature: -55...+125°C
R8-R11 R13 = Resistor_0603: Manufacturer: Vishay; PartNumber: CRCW06033R00JNEA; ValueManufacturerPartNumber: Res, SMD, 3, ±5%, 0603, 0.1W; TypeResistor: Res, SMD; Power: 0.1W; Tolerance: ±5%; Package: 0603; HelpURL: https://www.digikey.com/product-detail/en/vishay-dale/CRCW06033R00JNEA/541-3.0GCT-ND/1179308; Temperature: -55...+125°C
R12 = Resistor_2512: Manufacturer: Bourns; PartNumber: CRA2512-FZ-R010ELF; ValueManufacturerPartNumber: Res, SMD, 0.010, ±1%, 2512, 2W; TypeResistor: Res, SMD; Tolerance: ±1%; Package: 2512; HelpURL: https://www.electronshik.ru/item/BOURNS/CRA2512-FZ-R010ELF; Temperature: -55...+125°C
R16 R21 R40 R43 R54 = Resistor_0603: Manufacturer: Vishay; PartNumber: CRCW06030000Z0EA; ValueManufacturerPartNumber: Res, SMD, 0, ±1%, 0603, 0.1W; TypeResistor: Res, SMD; Power: 0.1W; Tolerance: ±1%; Package: 0603; HelpURL: https://www.digikey.com/product-detail/en/vishay-dale/CRCW06030000Z0EA/541-0.0GCT-ND/1179296; Temperature: -55...+125°C
  R54: ClassName: Polygon_direct
R17 = Resistor_0603: Manufacturer: Vishay; PartNumber: CRCW060391K0FKEA; ValueManufacturerPartNumber: Res, SMD, 107k, ±1%, 0603, 0.1W; TypeResistor: Res, SMD; Power: 0.1W; Tolerance: ±1%; Package: 0603; Temperature: -55...+125°C
R18 = Resistor_0603: Manufacturer: Vishay; PartNumber: CRCW06031M00FKEA; ValueManufacturerPartNumber: Res, SMD, 820k, ±1%, 0603, 0.1W; TypeResistor: Res, SMD; Power: 0.1W; Tolerance: ±1%; Package: 0603; Temperature: -55...+125°C
R19 = Resistor_0603: Manufacturer: Vishay; PartNumber: CRCW0603196KFKEA; ValueManufacturerPartNumber: Res, SMD, 196k, ±1%, 0603, 0.1W; TypeResistor: Res, SMD; Power: 0.1W; Tolerance: ±1%; Package: 0603; HelpURL: https://www.digikey.com/product-detail/en/vishay-dale/CRCW0603196KFKEA/541-196KHCT-ND/1180069; Temperature: -55...+125°C
R20 = Resistor_0603: Manufacturer: Vishay; PartNumber: CRCW06031K00FKEA; ValueManufacturerPartNumber: Res, SMD, 0, ±1%, 0603, 0.1W; TypeResistor: Res, SMD; Power: 0.1W; Tolerance: ±1%; Package: 0603; Temperature: -55...+125°C
R22 = Resistor_0603: Manufacturer: Vishay; PartNumber: CRCW060322K6FKEA; ValueManufacturerPartNumber: Res, SMD, 24k, ±1%, 0603, 0.1W; TypeResistor: Res, SMD; Power: 0.1W; Tolerance: ±1%; Package: 0603; Temperature: -55...+125°C
R23 = Resistor_0603: Manufacturer: Vishay; PartNumber: CRCW0603115KFKEA; ValueManufacturerPartNumber: Res, SMD, 120k, ±1%, 0603, 0.1W; TypeResistor: Res, SMD; Power: 0.1W; Tolerance: ±1%; Package: 0603; Temperature: -55...+125°C
R24 = Resistor_0603: Manufacturer: Vishay; PartNumber: CRCW060328K0FKEAHP; ValueManufacturerPartNumber: Res, SMD, 8.66k, ±1%, 0603, 0.1W; TypeResistor: Res, SMD; Power: 0.1W; Tolerance: ±1%; Package: 0603; Temperature: -55...+125°C
R25 = Resistor_0603: Manufacturer: Vishay; PartNumber: CRCW06035K60FKEA; ValueManufacturerPartNumber: Res, SMD, 1.69k, ±1%, 0603, 0.1W; TypeResistor: Res, SMD; Power: 0.1W; Tolerance: ±1%; Package: 0603; Temperature: -55...+125°C
R26 = Resistor_0603: Manufacturer: Vishay; PartNumber: CRCW0603200KFKEAC; ValueManufacturerPartNumber: Res, SMD, 200k, ±1%, 0603, 0.1W; TypeResistor: Res, SMD; Power: 0.1W; Tolerance: ±1%; Package: 0603; HelpURL: https://www.digikey.com/product-detail/en/vishay-dale/CRCW0603200KFKEAC/541-4027-1-ND/7928710; Temperature: -55...+125°C
R27 = Resistor_0603: Manufacturer: Vishay; PartNumber: CRCW060320K0FKEC; ValueManufacturerPartNumber: Res, SMD, 20k, ±1%, 0603, 0.1W; TypeResistor: Res, SMD; Power: 0.1W; Tolerance: ±1%; Package: 0603; HelpURL: https://www.digikey.com/product-detail/en/vishay-dale/CRCW060320K0FKEC/541-2993-1-ND/6073636; Temperature: -55...+125°C
R28 = Resistor_0603: Manufacturer: Vishay; PartNumber: CRCW06038K06FKEA; ValueManufacturerPartNumber: Res, SMD, 8.06k, ±1%, 0603, 0.1W; TypeResistor: Res, SMD; Power: 0.1W; Tolerance: ±1%; Package: 0603; HelpURL: https://www.digikey.com/product-detail/en/vishay-dale/CRCW06038K06FKEA/541-8.06KHCT-ND/1179912; Temperature: -55...+125°C
R29 = Resistor_0603: Manufacturer: Vishay; PartNumber: CRCW060311K3FKEA; ValueManufacturerPartNumber: Res, SMD, 4.87k, ±1%, 0603, 0.1W; TypeResistor: Res, SMD; Power: 0.1W; Tolerance: ±1%; Package: 0603; Temperature: -55...+125°C
R30 R50 = Resistor_0603: Manufacturer: Vishay; PartNumber: CRCW0603100KFKEA; ValueManufacturerPartNumber: Res, SMD, 100k, ±1%, 0603, 0.1W; TypeResistor: Res, SMD; Power: 0.1W; Tolerance: ±1%; Package: 0603; HelpURL: https://www.digikey.com/product-detail/en/vishay-dale/CRCW0603100KFKEA/541-100KHCT-ND/1180038; Temperature: -55...+125°C
R31 = Resistor_0603: Manufacturer: Vishay; PartNumber: CRCW06031K30FKEA; ValueManufacturerPartNumber: Res, SMD, 1.3k, ±1%, 0603, 0.1W; TypeResistor: Res, SMD; Power: 0.1W; Tolerance: ±1%; Package: 0603; HelpURL: https://www.digikey.com/product-detail/en/vishay-dale/CRCW06031K30FKEA/541-1.30KHCT-ND/1179821; Temperature: -55...+125°C
R32 = Resistor_0603: Manufacturer: Vishay; PartNumber: CRCW06031R00FKEAC; ValueManufacturerPartNumber: Res, SMD, 1, ±1%, 0603, 0.1W; TypeResistor: Res, SMD; Power: 0.1W; Tolerance: ±1%; Package: 0603; HelpURL: https://www.digikey.com/product-detail/en/vishay-dale/CRCW06031R00FKEAC/541-3956-1-ND/7928639; Temperature: -55...+125°C
R33 = Resistor_0603: Manufacturer: Vishay; PartNumber: CRCW0603549RFKEA; ValueManufacturerPartNumber: Res, SMD, 549, ±1%, 0603, 0.1W; TypeResistor: Res, SMD; Power: 0.1W; Tolerance: ±1%; Package: 0603; HelpURL: https://www.digikey.com/product-detail/en/vishay-dale/CRCW0603549RFKEA/541-549HCT-ND/1179779; Temperature: -55...+125°C
R34 = Resistor_0603: Manufacturer: Vishay; PartNumber: CRCW060321K0FKEA; ValueManufacturerPartNumber: Res, SMD, 21k, ±1%, 0603, 0.1W; TypeResistor: Res, SMD; Power: 0.1W; Tolerance: ±1%; Package: 0603; HelpURL: https://www.digikey.com/product-detail/en/vishay-dale/CRCW060321K0FKEA/541-21.0KHCT-ND/1179958; Temperature: -55...+125°C
R35 R38 R39 R49 = Resistor_0603: Manufacturer: Vishay; PartNumber: CRCW060310K0JNEAC; ValueManufacturerPartNumber: Res, SMD, 10k, ±5%, 0603, 0.1W; TypeResistor: Res, SMD; Power: 0.1W; Tolerance: ±5%; Package: 0603; HelpURL: https://www.digikey.com/product-detail/en/vishay-dale/CRCW060310K0JNEAC/541-3957-1-ND/7928640; Temperature: -55...+125°C
R36 = Resistor_0603: Manufacturer: Vishay; PartNumber: CRCW06033K01FKEA; ValueManufacturerPartNumber: Res, SMD, 3.01k, ±1%, 0603, 0.1W; TypeResistor: Res, SMD; Power: 0.1W; Tolerance: ±1%; Package: 0603; HelpURL: https://www.digikey.com/product-detail/en/vishay-dale/CRCW06033K01FKEA/541-3.01KHCT-ND/1179862; Temperature: -55...+125°C
R37 R45 = Resistor_0603: Manufacturer: Vishay; PartNumber: CRCW06030000Z0EA; ValueManufacturerPartNumber: Res, SMD, 0, ±1%, 0603, 0.1W; TypeResistor: Res, SMD; Power: 0.1W; Tolerance: ±1%; Value: 0; Package: 0603; HelpURL: https://www.digikey.com/product-detail/en/vishay-dale/CRCW06030000Z0EA/541-0.0GCT-ND/1179296; Temperature: -55...+125°C
R41 = Resistor_0603: Manufacturer: YAGEO; PartNumber: RC0603FR-07365KL; ValueManufacturerPartNumber: Res, SMD, 365k, ±1%, 0603, 0.1W; TypeResistor: Res, SMD; Power: 0.1W; Tolerance: ±1%; Package: 0603; HelpURL: https://www.electronshik.ru/item/YAG/RC0603FR-07365KL; Temperature: -55...+125°C
R42 = Resistor_0603: Manufacturer: Vishay; PartNumber: CRCW060353K6FKEA; ValueManufacturerPartNumber: Res, SMD, 53.6k, ±1%, 0603, 0.1W; TypeResistor: Res, SMD; Power: 0.1W; Tolerance: ±1%; Package: 0603; HelpURL: https://www.digikey.com/product-detail/en/vishay-dale/CRCW060353K6FKEA/541-53.6KHCT-ND/1180007; Temperature: -55...+125°C
R44 = Resistor_0603: Manufacturer: Vishay; PartNumber: CRCW060325K5FKEA; ValueManufacturerPartNumber: Res, SMD, 25.5k, ±1%, 0603, 0.1W; TypeResistor: Res, SMD; Power: 0.1W; Tolerance: ±1%; Package: 0603; HelpURL: https://www.digikey.com/product-detail/en/vishay-dale/CRCW060325K5FKEA/541-25-5KHCT-ND/1179968; Temperature: -55...+125°C
R46 = Resistor_0603: Manufacturer: Vishay; PartNumber: CRCW060311K5FKEA; ValueManufacturerPartNumber: Res, SMD, 11.5k, ±1%, 0603, 0.1W; TypeResistor: Res, SMD; Power: 0.1W; Tolerance: ±1%; Package: 0603; HelpURL: https://www.digikey.com/product-detail/en/vishay-dale/CRCW060311K5FKEA/541-11.5KHCT-ND/1179930; Temperature: -55...+125°C
R47 = Resistor_0603: Manufacturer: Vishay; PartNumber: CRCW06034K99FKEAC; ValueManufacturerPartNumber: Res, SMD, 4.99k, ±1%, 0603, 0.1W; TypeResistor: Res, SMD; Power: 0.1W; Tolerance: ±1%; Package: 0603; HelpURL: https://www.digikey.com/product-detail/en/vishay-dale/CRCW06034K99FKEAC/541-3985-1-ND/7928668; Temperature: -55...+125°C
R48 = Resistor_0603: Manufacturer: Vishay; PartNumber: CRCW0603110KFKEA; ValueManufacturerPartNumber: Res, SMD, 110k, ±1%, 0603, 0.1W; TypeResistor: Res, SMD; Power: 0.1W; Tolerance: ±1%; Package: 0603; HelpURL: https://www.digikey.com/product-detail/en/vishay-dale/CRCW0603110KFKEA/541-110KHCT-ND/1180042; Temperature: -55...+125°C
R51 = Resistor_0603: Manufacturer: Vishay; PartNumber: CRCW060335K7FKEA; ValueManufacturerPartNumber: Res, SMD, 35.7k, ±1%, 0603, 0.1W; TypeResistor: Res, SMD; Power: 0.1W; Tolerance: ±1%; Package: 0603; HelpURL: https://www.digikey.com/product-detail/en/vishay-dale/CRCW060335K7FKEA/541-35.7KHCT-ND/1179985; Temperature: -55...+125°C
R52 = Resistor_0603: Manufacturer: Vishay; PartNumber: CRCW060333K2FKEAC; ValueManufacturerPartNumber: Res, SMD, 33.2k, ±1%, 0603, 0.1W; TypeResistor: Res, SMD; Power: 0.1W; Tolerance: ±1%; Package: 0603; HelpURL: https://www.digikey.com/product-detail/en/vishay-dale/CRCW060333K2FKEAC/541-4052-1-ND/7928735; Temperature: -55...+125°C
R53 = Resistor_0603: Manufacturer: Vishay; PartNumber: CRCW06031K00FKEA; ValueManufacturerPartNumber: Res, SMD, 1k, ±1%, 0603, 0.1W; TypeResistor: Res, SMD; Power: 0.1W; Tolerance: ±1%; Package: 0603; HelpURL: https://www.digikey.com/product-detail/en/vishay-dale/CRCW06031K00FKEA/541-1.00KHCT-ND/1179809; Temperature: -55...+125°C
R55 = NTC: Manufacturer: TDK; PartNumber: B57401V2472J062; ValueManufacturerPartNumber: NTC resistor, 4.7k, ±5%, 0805, 3650K, -55...+125°C; TypeResistor: NTC resistor; MaxCurrent: 3650K; Package: 0805; HelpURL: https://www.digikey.com/product-detail/en/tdk-electronics-inc/B57401V2472J062/495-7444-1-ND/6073136; Temperature: -55...+125°C
R56 = Resistor_0603: Manufacturer: Vishay; PartNumber: CRCW060328K0FKEAHP; ValueManufacturerPartNumber: Res, SMD, 28k, ±1%, 0603, 0.1W; TypeResistor: Res, SMD; Power: 0.1W; Tolerance: ±1%; Package: 0603; HelpURL: https://www.digikey.com/product-detail/en/vishay-dale/CRCW060328K0FKEAHP/541-28.0KSCT-ND/2826000; Temperature: -55...+125°C
R57 = Resistor_0603: Manufacturer: Vishay; PartNumber: CRCW0603330RFKEAC; ValueManufacturerPartNumber: Res, SMD, 330, ±1%, 0603, 0.1W; TypeResistor: Res, SMD; Power: 0.1W; Tolerance: ±1%; Package: 0603; HelpURL: https://www.digikey.com/product-detail/en/vishay-dale/CRCW0603330RFKEAC/541-4026-1-ND/7928709; Temperature: -55...+125°C
R58 = Resistor_0805: Manufacturer: Vishay; PartNumber: CRCW08055K10FKEA; ValueManufacturerPartNumber: Resistor film, 5.1k, ±1%, 0805, 0.125W; TypeResistor: Resistor film; Power: 0.125W; Tolerance: ±1%; Package: 0805; HelpURL: https://www.digikey.com/product-detail/en/vishay-dale/CRCW08055K10FKEA/541-5.10KCCT-ND/1180863; Temperature: -55...+125°C
R59 = Resistor_0603: Manufacturer: Vishay; PartNumber: CRCW06038K45FKEA; ValueManufacturerPartNumber: Res, SMD, 8.45k, ±1%, 0603, 0.1W; TypeResistor: Res, SMD; Power: 0.1W; Tolerance: ±1%; Package: 0603; HelpURL: https://www.digikey.com/product-detail/en/vishay-dale/CRCW06038K45FKEA/541-8.45KHCT-ND/1179916; Temperature: -55...+125°C
SB3 = Button_tactile: Manufacturer: TE Connectivity; ValueManufacturerPartNumber: Tactile button, 6x6mm; PartNumber: FSM2JSMAATR; TypeButton: Tactile button; HelpURL: https://www.digikey.com/product-detail/en/te-connectivity-alcoswitch-switches/FSM2JSMAATR/450-1792-1-ND/3503931; Package: 6x6mm
VD1 = Schottky_single_TDFN: Manufacturer: ON Semiconductor; ValueManufacturerPartNumber: Schottky diode, 100V, 10A, 690mV @ 10A, 8-PowerTDFN, 5 Leads; TypeDiode: Schottky diode; Voltage: 100V; Current: 10A; VoltageDrop: 690mV @ 10A; Package: 8-PowerTDFN, 5 Leads; HelpURL: https://www.digikey.com/product-detail/en/on-semiconductor/NTS10100MFST3G/NTS10100MFST3GCT-ND/6050812; ClassName: Polygon_direct
VD2 = TVS_single_uni: Manufacturer: Diodes Incorporated; ValueManufacturerPartNumber: TVS DIODE UNI, 48V, 400W, SMA; TypeDiode: TVS DIODE UNI; Current: 400W; Package: SMA; HelpURL: https://www.digikey.com/product-detail/en/diodes-incorporated/SMAJ48A-13-F/SMAJ48A-FDICT-ND/816024; Temperature: -55...+150°C
VD3 VD4 = Diode_single: Manufacturer: Central Semi.; ValueManufacturerPartNumber: Ultra Fast Rectifier Single, 200V, 1A, SOD-123F; TypeDiode: Ultra Fast Rectifier Single; Voltage: 200V; Current: 1A; VoltageDrop: 1.7V @ 1A; RecoveryTime: 50ns; Package: SOD-123F; HelpURL: https://www.digikey.com/product-detail/en/central-semiconductor-corp/CMMR1U-02-TR-PBFREE/1514-CMMR1U-02TRPBFREECT-ND/4807014; Temperature: -65...+150°C
VD5 VD9 = LED_single: Manufacturer: Wurth; ValueManufacturerPartNumber: LED, 0603, GREEN; PartNumber: 150060VS75000; TypeDiode: LED; Current: 20mA; VoltageDrop: 2V; Package: 0603; HelpURL: https://www.digikey.com/product-detail/en/wurth-electronics-inc/150060VS75000/732-4980-1-ND/4489904; Temperature: -55...+150°C
VD6 = Zener_single: Manufacturer: Diodes Incorporated; ValueManufacturerPartNumber: Zener diode, 12V, 300mW, SOD-523; TypeDiode: Zener diode; Current: 300mW; VoltageDrop: 900mV @ 10mA; Package: SOD-523; HelpURL: https://www.digikey.com/product-detail/en/diodes-incorporated/BZT52C12T-7/BZT52C12T-7DICT-ND/2181075; Temperature: -60...+150°C
VD7 = TVS_single_uni: Manufacturer: Diodes Incorporated; ValueManufacturerPartNumber: TVS DIODE UNI, 70V, 400W, SMA; TypeDiode: TVS DIODE UNI; Current: 400W; Package: SMA; HelpURL: https://www.digikey.com/product-detail/en/diodes-incorporated/SMAT70A-13-F/SMAT70A-FDICT-ND/804910; Temperature: -55...+150°C
VD8 = TVS_single_uni: Manufacturer: Diodes Incorporated; ValueManufacturerPartNumber: TVS DIODE UNI, 24V, 400W, SMA; TypeDiode: TVS DIODE UNI; Current: 400W; Package: SMA; HelpURL: https://www.digikey.com/product-detail/en/diodes-incorporated/SMAJ24A-13-F/SMAJ24A-FDICT-ND/724994; Temperature: -55...+150°C
VD10 VD19 VD20 = Schottky_single: Manufacturer: Vishay; ValueManufacturerPartNumber: Schottky diode, 100V, 1A, , SMA; TypeDiode: Schottky diode; Voltage: 100V; Current: 1A; VoltageDrop: 780mV @ 1A; Package: SMA; HelpURL: https://www.digikey.com/product-detail/en/vishay-semiconductor-diodes-division/VS-10MQ100NTRPBF/10MQ100NPBFCT-ND/812503; Temperature: -55...+150°C; ClassName: Polygon_direct
VT1-VT4 = MOSFET_N_TDSON-8: Транзистор; Manufacturer: Infineon Technologies; CurrentDS: 76A; RDS: 11mOhm; Analog: BSC070N10NS3 G; HelpURL: https://www.digikey.com/product-detail/en/infineon-technologies/BSC110N15NS5ATMA1/BSC110N15NS5ATMA1TR-ND/5959916; Package: PG-TDSON-8; TypeTransistor: MOSFET N-ch; ValueManufacturerPartNumber: MOSFET N-ch, 150V, PG-TDSON-8; VoltageDS: 150V; ClassName: Polygon_direct
VT5 = BJT_NPN_132: Manufacturer: Diodes Inc.; ValueManufacturerPartNumber: NPN transistor, 40V, 200mA, SOT-23; TypeTransistor: NPN transistor; VoltageCE: 40V; CurrentCE: 200mA; Frequency: 300MHz; CurrentGain: 100 @ 10mA, 1V; MaxPower: 300mW; Package: SOT-23; HelpURL: https://www.digikey.com/product-detail/en/diodes-incorporated/MMBT3904-7-F/MMBT3904-FDICT-ND/815727; Temperature: -55...+150°C; ClassName: Polygon_direct
VT6 = MOSFET_N_TDSON-8: Транзистор; Manufacturer: ON Semiconductor; ValueManufacturerPartNumber: MOSFET N-ch, 100V, 12A, 8-PowerTDFN; CurrentDS: 12A; GateCharge: 55nC @ 10V; MaxPower: 2.5W; RDS: 8mOhm @ 13A, 10V; TypeTransistor: MOSFET N-ch; VoltageDS: 100V; HelpURL: https://www.digikey.com/product-detail/en/on-semiconductor/FDMS86101/FDMS86101CT-ND/2060386; Package: 8-PowerTDFN; Temperature: -55°C ~ 150°C (TJ); ClassName: Polygon_direct
XP1 = 5000: Test Point, Miniature, Red, TH; Manufacturer: Keystone; ValueManufacturerPartNumber: Test Point, Red; Note: "PV+"; ContactFinish: Silver; PartNumber: 5000; PackageReference: Red Miniature Testpoint; TypeConnector: Test Point; MountType: TH; ComponentLink1Description: Datasheet URL; Color: Red; HelpURL: https://www.digikey.com/product-detail/en/keystone-electronics/5000/36-5000-ND/255326
XP2 = 5000: Test Point, Miniature, Red, TH; Manufacturer: Keystone; ValueManufacturerPartNumber: Test Point, Red; Note: "VBAT"; ContactFinish: Silver; PartNumber: 5000; PackageReference: Red Miniature Testpoint; TypeConnector: Test Point; MountType: TH; ComponentLink1Description: Datasheet URL; Color: Red; HelpURL: https://www.digikey.com/product-detail/en/keystone-electronics/5000/36-5000-ND/255326
XP3 = 5000: Test Point, Miniature, Red, TH; Manufacturer: Keystone; ValueManufacturerPartNumber: Test Point, Red; Note: "DC"; ContactFinish: Silver; PartNumber: 5000; PackageReference: Red Miniature Testpoint; TypeConnector: Test Point; MountType: TH; ComponentLink1Description: Datasheet URL; Color: Red; HelpURL: https://www.digikey.com/product-detail/en/keystone-electronics/5000/36-5000-ND/255326
XP4 XP10 = 5001: Test Point, Miniature, Black, TH; ValueManufacturerPartNumber: Test Point, Black; Manufacturer: Keystone; ContactFinish: Silver; PartNumber: 5001; Color: Black; HelpURL: https://www.digikey.com/product-detail/en/keystone-electronics/5001/36-5001-ND/255327; TypeConnector: Test Point
XP5 = 5001: Test Point, Miniature, Black, TH; ValueManufacturerPartNumber: Test Point, Black; Manufacturer: Keystone; ContactFinish: Silver; Note: "GND"; PartNumber: 5001; Color: Black; HelpURL: https://www.digikey.com/product-detail/en/keystone-electronics/5001/36-5001-ND/255327; TypeConnector: Test Point
XP6 = 5000: Test Point, Miniature, Red, TH; Manufacturer: Keystone; ValueManufacturerPartNumber: Test Point, Red; ContactFinish: Silver; PartNumber: 5000; PackageReference: Red Miniature Testpoint; TypeConnector: Test Point; MountType: TH; ComponentLink1Description: Datasheet URL; Color: Red; HelpURL: https://www.digikey.com/product-detail/en/keystone-electronics/5000/36-5000-ND/255326
XT1 XT2 XT4 = Connector_6PCV-02: Manufacturer: TE Connectivity; ValueManufacturerPartNumber: Connector, 2pin, 9.53mm, 300VAC, 25A; VoltageMax: 300VAC; Pitch: 9.53mm; CurrentMax: 25A; Multichannel: 2pin; HelpURL: https://www.digikey.com/products/en?keywords=6PCV-02-006; TypeConnector: Connector
XT3 XT6 = Connector_terminal_2pin: Manufacturer: Molex; ValueManufacturerPartNumber: Terminal connector, 2pin, 3.5mm, 300VAC, 12A; PartNumber: 0393570002; TypeConnector: Terminal connector; VoltageMax: 300VAC; Pitch: 3.5mm; CurrentMax: 12A; Multichannel: 2pin; HelpURL: https://www.digikey.com/product-detail/en/molex/0393570002/WM7877-ND/946543